# Altium schematic sheet 公共电路.SchDoc: 阿波罗工业控制器公共电路
size A4; Organization: *月无声智控部; Revision: V1.4; MakeTime: 2014年3月4日
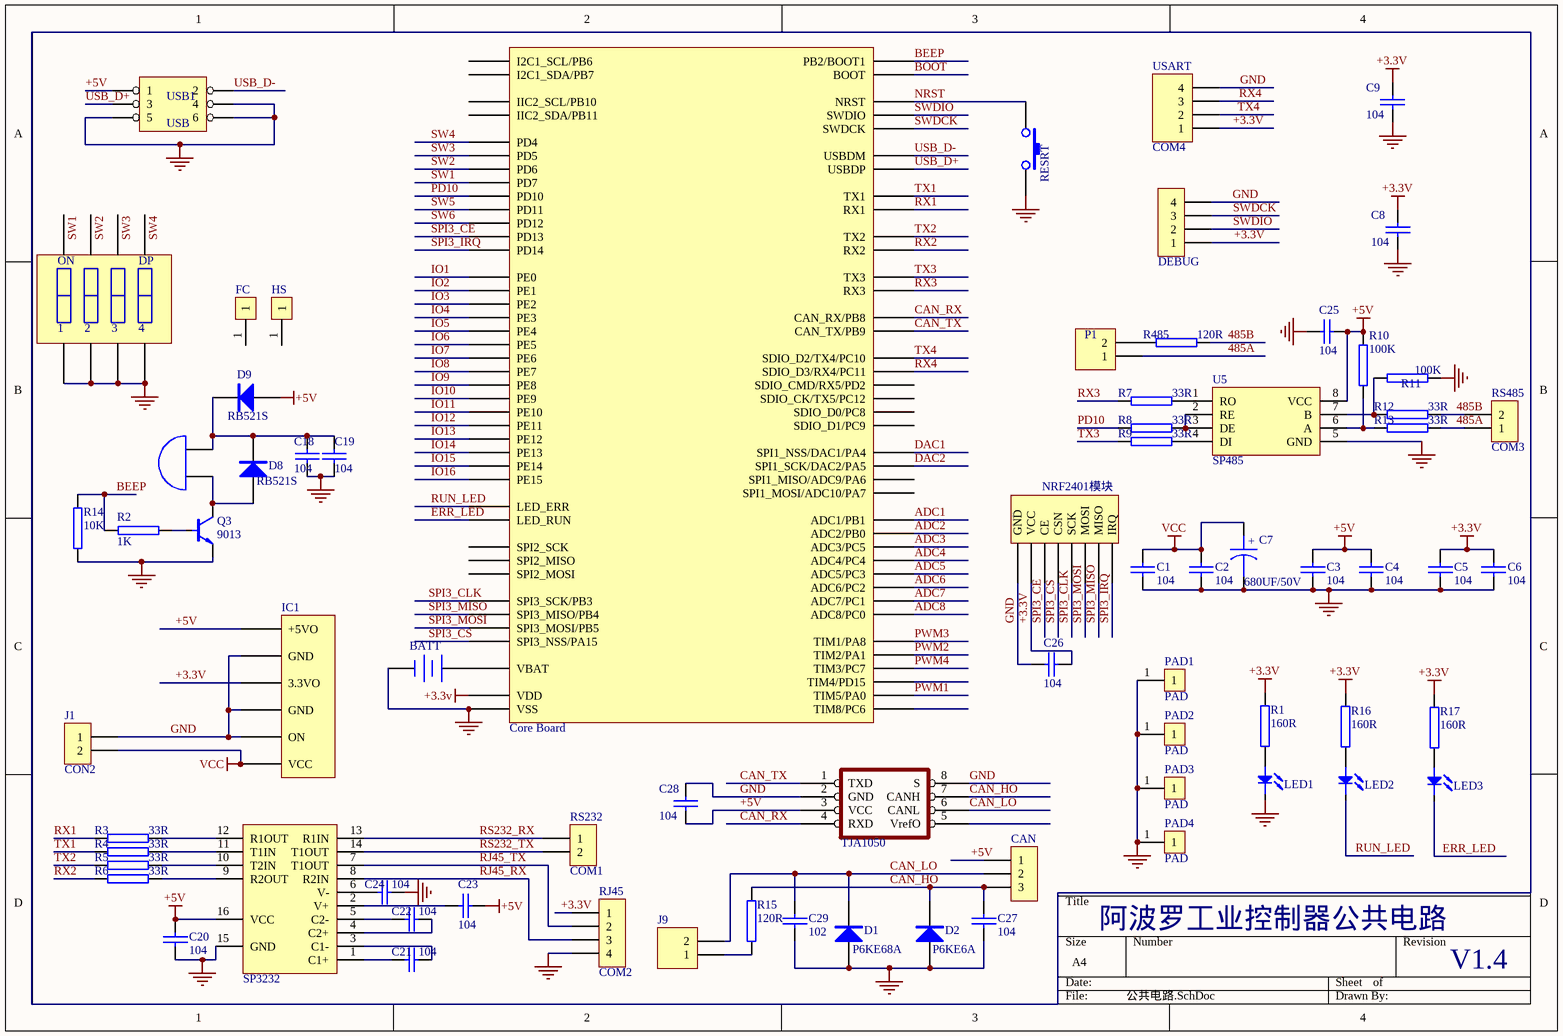
[diagram p0: 公共电路.SchDoc]

## Parts
BATT  (no value)  [MINI-BAT]
C1  104  [0603A]
C2  104  [0603A]
C3  104  [0603A]
C4  104  [0603A]
C5  104  [0603A]
C6  104  [0603A]
C7  680UF/50V  [电解电容10mm]
C8  104  [0603A]
C9  104  [0603A]
C18  104  [0603A]
C19  104  [0603A]
C20  104  [0603A]
C21  104  [0603A]
C22  104  [0603A]
C23  104  [0603A]
C24  104  [0603A]
C25  104  [0603A]
C26  104  [0603A]
C27  104  [0603A]
C28  104  [0603A]
C29  102  [0603A]
CAN  CON3  (value not drawn)
D1  P6KE68A
D2  P6KE6A
D8  RB521S
D9  RB521S
FC  (no value)  [fc]
HS  (no value)  [HS]
IC1  (no value)
IC2  Core Board  [核心板-物联网1]
J1  CON2
J2  DEBUG  [HDR1X4]
J7  NRF2401模块  [NRF24L01]
J9  (no value)  [HDR1X2]
K1  拨码开关*4  (value not drawn)
LED1  PLED  [LED2.5]  (value not drawn)
LED2  RUN  [LED2.5]  (value not drawn)
LED3  ERR  [LED2.5]  (value not drawn)
P1  (no value)  [HDR1X2]
PAD1  PAD  [PAD]
PAD2  PAD  [PAD]
PAD3  PAD  [PAD]
PAD4  PAD  [PAD]
Q3  9013  [SOT23]
R1  160R  [0603A]
R2  1K  [0603A]
R3  33R  [0603A]
R4  33R  [0603A]
R5  33R  [0603A]
R6  33R  [0603A]
R7  33R  [0603A]
R8  33R  [0603A]
R9  33R  [0603A]
R10  100K  [0603A]
R11  100K  [0603A]
R12  33R  [0603A]
R13  33R  [0603A]
R14  10K  [0603A]
R15  120R  [0603A]
R16  160R  [0603A]
R17  160R  [0603A]
R485  120R  [0603A]
RJ45  COM2  [HDR1X4]
RS232  COM1
RS485  COM3
S2  RESRT  [SW-PB2]
U3  (no value)
U4  SP3232  [TSSOP16]
U5  SP485  [SO8_L]
U6  TJA1050  [SO8_L]
USART  COM4  [HDR1X4]
USB1  USB  [USB-B3]

## Nets
+3.3V: C5.1 C6.1 C8.1 C9.1 C26.2 IC1.3(3.3VO) IC2.2(VDD) J2.1 J7.2(VCC) R1.1 R16.1 R17.1 RJ45.1 USART.1
+5V: C3.1 C4.1 C20.1 C23.2 C25.2 C28.2 CAN.1 D9.A IC1.1(+5VO) R10.2 U4.16(VCC) U5.8(VCC) U6.3(VCC) USB1.1
GND: BATT.2(-) C1.2 C2.2 C3.2 C4.2 C5.2 C6.2 C7.2 C8.2 C9.2 C18.2 C19.2 C20.2 C24.2 C25.1 C26.1 C27.2 C28.1 C29.1 D1.A D2.A IC1.2(GND) IC1.4(GND) IC1.5(ON) IC2.1(VSS) J1.1 J2.4 J7.1(GND) K1.5 K1.6 K1.7 K1.8 LED1.K PAD1.1 PAD2.1 PAD3.1 PAD4.1 Q3.2(e) R11.2 R14.1 RJ45.4 S2.2 U4.15(GND) U5.5(GND) U6.2(GND) U6.8(S) USART.4 USB1.4 USB1.5 USB1.6
VCC: C1.1 C2.1 C7.1 IC1.6(VCC) J1.2
485A: P1.1 R13.2 RS485.1
485B: R12.2 R485.2 RS485.2
ADC1: IC2.33(ADC1/PB1)
ADC2: IC2.34(ADC2/PB0)
ADC3: IC2.35(ADC3/PC5)
ADC4: IC2.36(ADC4/PC4)
ADC5: IC2.48(ADC5/PC3)
ADC6: IC2.47(ADC6/PC2)
ADC7: IC2.50(ADC7/PC1)
ADC8: IC2.49(ADC8/PC0)
BEEP: IC2.31(PB2/BOOT1) R2.1 R14.2
BOOT: IC2.3(BOOT)
CAN_HO: C27.1 CAN.3 D2.K R15.1 U6.7(CANH)
CAN_LO: C29.2 CAN.2 D1.K J9.2 U6.6(CANL)
CAN_RX: IC2.68(CAN_RX/PB8) U6.4(RXD)
CAN_TX: IC2.67(CAN_TX/PB9) U6.1(TXD)
DAC1: IC2.39(SPI1_NSS/DAC1/PA4)
DAC2: IC2.40(SPI1_SCK/DAC2/PA5)
ERR_LED: IC2.12(LED_RUN) LED3.K
IO1: IC2.58(PE0)
IO2: IC2.57(PE1)
IO3: IC2.56(PE2)
IO4: IC2.55(PE3)
IO5: IC2.54(PE4)
IO6: IC2.53(PE5)
IO7: IC2.52(PE6)
IO8: IC2.51(PE7)
IO9: IC2.30(PE8)
IO10: IC2.29(PE9)
IO11: IC2.28(PE10)
IO12: IC2.27(PE11)
IO13: IC2.26(PE12)
IO14: IC2.25(PE13)
IO15: IC2.24(PE14)
IO16: IC2.23(PE15)
NRST: IC2.4(NRST) S2.1
PD10: IC2.13(PD10) R8.1
PWM1: IC2.45(TIM5/PA0)
PWM2: IC2.46(TIM2/PA1)
PWM3: IC2.43(TIM1/PA8)
PWM4: IC2.44(TIM3/PC7)
RJ45_RX: RJ45.3 U4.8(R2IN)
RJ45_TX: RJ45.2 U4.7(T1OUT)
RS232_RX: RS232.1 U4.13(R1IN)
RS232_TX: RS232.2 U4.14(T1OUT)
RUN_LED: IC2.11(LED_ERR) LED2.K
RX1: IC2.10(RX1) R3.1
RX2: IC2.18(RX2) R6.1
RX3: IC2.20(RX3) R7.1
RX4: IC2.80(SDIO_D3/RX4/PC11) USART.3
SPI3_CE: IC2.60(PD13) J7.3(CE)
SPI3_CLK: IC2.73(SPI3_SCK/PB3) J7.5(SCK)
SPI3_CS: IC2.74(SPI3_NSS/PA15) J7.4(CSN)
SPI3_IRQ: IC2.59(PD14) J7.8(IRQ)
SPI3_MISO: IC2.72(SPI3_MISO/PB4) J7.7(MISO)
SPI3_MOSI: IC2.71(SPI3_MOSI/PB5) J7.6(MOSI)
SW1: IC2.66(PD7) K1.1
SW2: IC2.65(PD6) K1.2
SW3: IC2.64(PD5) K1.3
SW4: IC2.63(PD4) K1.4
SW5: IC2.62(PD11)
SW6: IC2.61(PD12)
SWDCK: IC2.6(SWDCK) J2.3
SWDIO: IC2.5(SWDIO) J2.2
TX1: IC2.9(TX1) R4.1
TX2: IC2.17(TX2) R5.1
TX3: IC2.19(TX3) R9.1
TX4: IC2.79(SDIO_D2/TX4/PC10) USART.2
USB_D+: IC2.8(USBDP) USB1.3
USB_D-: IC2.7(USBDM) USB1.2
NetBATT_1: BATT.1(+) IC2.32(VBAT)
NetC18_1: C18.1 C19.1 D8.K D9.K U3.1(A)
NetC21_1: C21.1 U4.1(C1+)
NetC21_2: C21.2 U4.3(C1-)
NetC22_1: C22.1 U4.5(C2-)
NetC22_2: C22.2 U4.4(C2+)
NetC23_1: C23.1 U4.2(V+)
NetC24_1: C24.1 U4.6(V-)
NetD8_A: D8.A Q3.3(c) U3.2(B)
NetJ9_1: J9.1 R15.2
NetLED1_A: LED1.A R1.2
NetLED2_A: LED2.A R16.2
NetLED3_A: LED3.A R17.2
NetP1_2: P1.2 R485.1
NetQ3_1: Q3.1(b) R2.2
NetR3_2: R3.2 U4.12(R1OUT)
NetR4_2: R4.2 U4.11(T1IN)
NetR5_2: R5.2 U4.10(T2IN)
NetR6_2: R6.2 U4.9(R2OUT)
NetR7_2: R7.2 U5.1(RO)
NetR8_2: R8.2 U5.2(RE) U5.3(DE)
NetR9_2: R9.2 U5.4(DI)
NetR10_1: R10.1 R13.1 U5.6(A)
NetR11_1: R11.1 R12.1 U5.7(B)

Not connected (* = marked no-connect by the designer): FC 1; HS 1; IC2 14(SPI2_SCK) 15(SPI2_MISO) 16(SPI2_MOSI) 21(IIC2_SDA/PB11) 22(IIC2_SCL/PB10) 37(SPI1_MISO/ADC9/PA6) 38(SPI1_MOSI/ADC10/PA7) 41(TIM8/PC6) 42(TIM4/PD15) 69(I2C1_SDA/PB7) 70(I2C1_SCL/PB6) 75(SDIO_D1/PC9) 76(SDIO_D0/PC8) 77(SDIO_CMD/RX5/PD2) 78(SDIO_CK/TX5/PC12); U6 5(VrefO)

## Notes on the sheet
- (in symbol CAPACITOR POL) +
- (in symbol 拨码开关*4) ON; DP

## Library data of the parts
BATT = Battery: XH414H; Published: 24-Mar-1999; LatestRevisionDate: 17-Jul-2002; LatestRevisionNote: Re-released for DXP Platform.; PackageReference: BAT-2; Publisher: Altium Limited; PackageDescription: Battery; 2 Leads
C1-C6 C8 C9 C18-C29 = CAP: Capacitor
C7 = CAPACITOR POL: Capacitor
FC HS = PAD
IC2 = 物联网核心板
J2 RJ45 = CON4
J9 P1 = Header 2: Header, 2-Pin; LatestRevisionDate: 17-Jul-2002; LatestRevisionNote: Re-released for DXP Platform.; Publisher: Altium Limited
LED1-LED3 = LED
Q3 = NPN
R1-R17 R485 = RES2
RS232 RS485 = CON2
S2 = SW-PB
U4 = SP3232EEA
USART = Header 4: Header, 4-Pin; LatestRevisionDate: 17-Jul-2002; LatestRevisionNote: Re-released for DXP Platform.; Publisher: Altium Limited
USB1 = HEADER 3X2